# EAGLE design BusConOld (EAGLE 6.6.0)
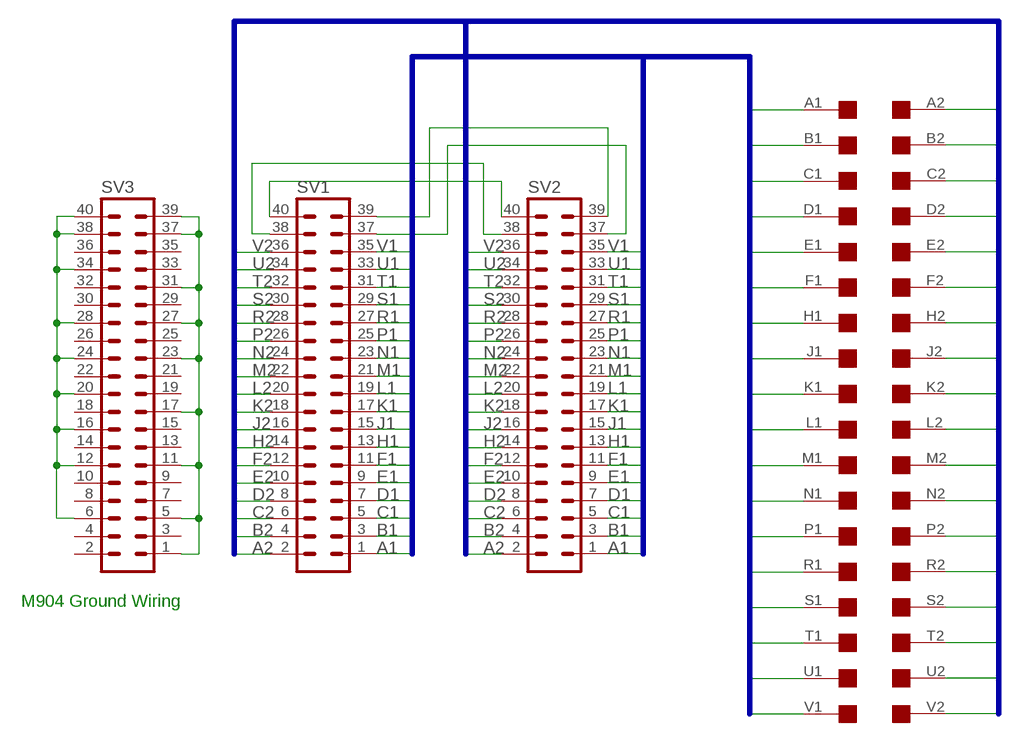
[diagram p0: schematic, sheet 1]

## Parts
SV1  MA20-2W  [MA20-2W]
SV2  MA20-2W  [MA20-2W]
SV3  MA20-2W  [MA20-2W]
U$1  DEC-FLIPCHIP  [DEC-FLIPCHIP]

## Nets
A1: SV1.1 SV2.1 U$1.A1
A2: SV1.2 SV2.2 U$1.A2
B1: SV1.3 SV2.3 U$1.B1
B2: SV1.4 SV2.4 U$1.B2
C1: SV1.5 SV2.5 U$1.C1
C2: SV1.6 SV2.6 U$1.C2
D1: SV1.7 SV2.7 U$1.D1
D2: SV1.8 SV2.8 U$1.D2
E1: SV1.9 SV2.9 U$1.E1
E2: SV1.10 SV2.10 U$1.E2
F1: SV1.11 SV2.11 U$1.F1
F2: SV1.12 SV2.12 U$1.F2
H1: SV1.13 SV2.13 U$1.H1
H2: SV1.14 SV2.14 U$1.H2
J1: SV1.15 SV2.15 U$1.J1
J2: SV1.16 SV2.16 U$1.J2
K1: SV1.17 SV2.17 U$1.K1
K2: SV1.18 SV2.18 U$1.K2
L1: SV1.19 SV2.19 U$1.L1
L2: SV1.20 SV2.20 U$1.L2
M1: SV1.21 SV2.21 U$1.M1
M2: SV1.22 SV2.22 U$1.M2
N1: SV1.23 SV2.23 U$1.N1
N2: SV1.24 SV2.24 U$1.N2
N$1: SV1.40 SV2.40
N$2: SV1.38 SV2.38
N$3: SV1.37 SV2.37
N$4: SV1.39 SV2.39
N$5: SV3.1 SV3.5 SV3.11 SV3.17 SV3.23 SV3.27 SV3.31 SV3.37 SV3.39
N$6: SV3.6 SV3.12 SV3.16 SV3.20 SV3.24 SV3.28 SV3.34 SV3.38 SV3.40
P1: SV1.25 SV2.25 U$1.P1
P2: SV1.26 SV2.26 U$1.P2
R1: SV1.27 SV2.27 U$1.R1
R2: SV1.28 SV2.28 U$1.R2
S1: SV1.29 SV2.29 U$1.S1
S2: SV1.30 SV2.30 U$1.S2
T1: SV1.31 SV2.31 U$1.T1
T2: SV1.32 SV2.32 U$1.T2
U1: SV1.33 SV2.33 U$1.U1
U2: SV1.34 SV2.34 U$1.U2
V1: SV1.35 SV2.35 U$1.V1
V2: SV1.36 SV2.36 U$1.V2
Unconnected: SV3.2 SV3.3 SV3.4 SV3.7 SV3.8 SV3.9 SV3.10 SV3.13 SV3.14 SV3.15 SV3.18 SV3.19 SV3.21 SV3.22 SV3.25 SV3.26 SV3.29 SV3.30 SV3.32 SV3.33 SV3.35 SV3.36

## Buses
A1,B1,C1,D1,E1,F1,H1,J1,K1,L1,M1,N1,P1,R1,S1,T1,U1,V1
A2,B2,C2,D2,E2,F2,H2,J2,K2,L2,M2,N2,P2,R2,S2,T2,U2,V2

## Notes on the sheet
- M904 Ground Wiring

## Library data of the parts
SV1-SV3 = con-lstb:MA20-2W: PIN HEADER; OC_FARNELL: unknown; OC_NEWARK: unknown
U$1 = con-dec:DEC-FLIPCHIP: DEC Flip-Chip single card fingers

## Board
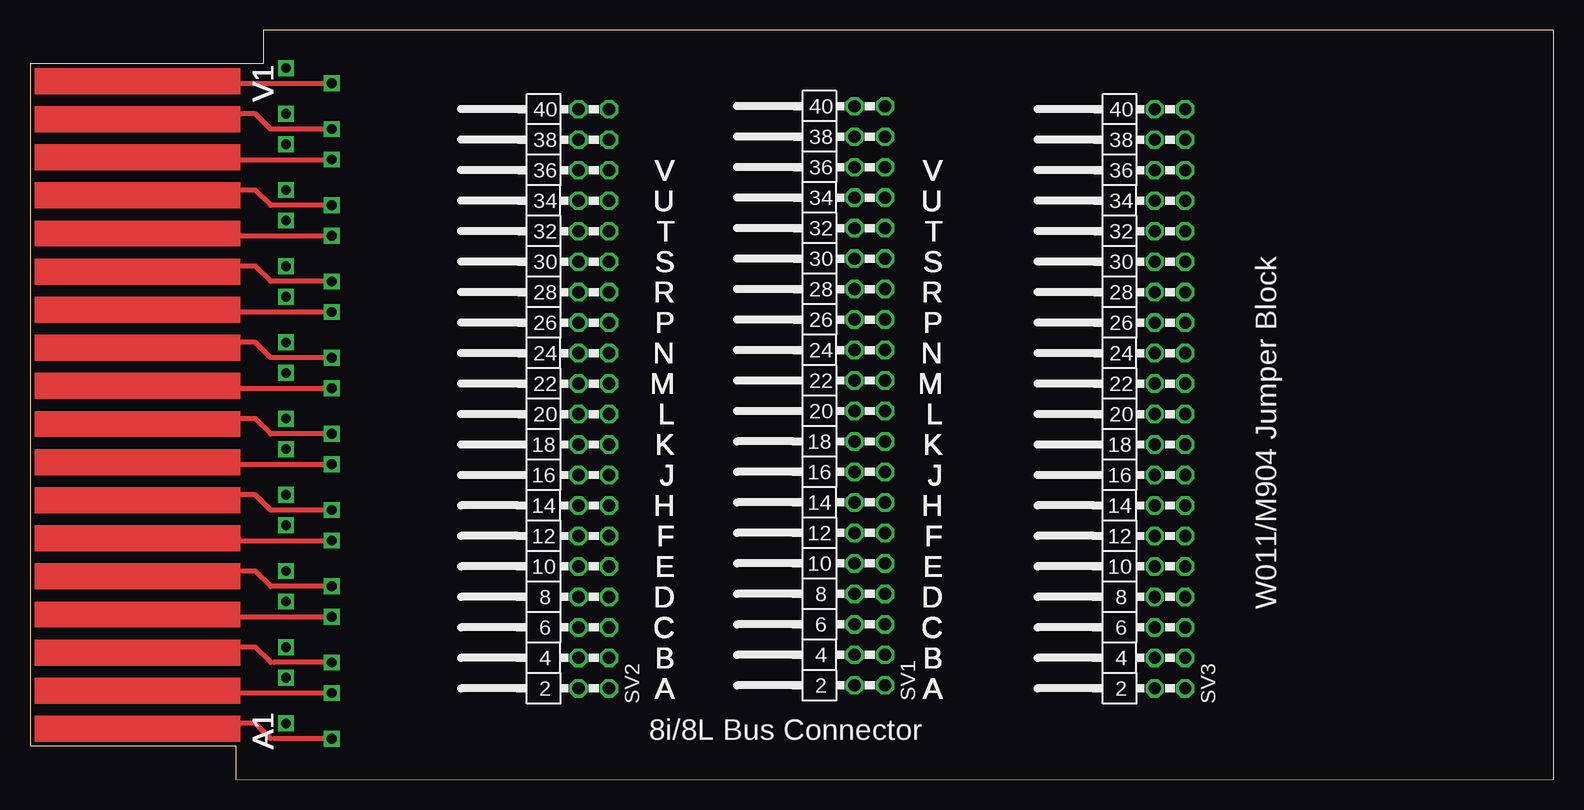
[diagram p1: board, top side]
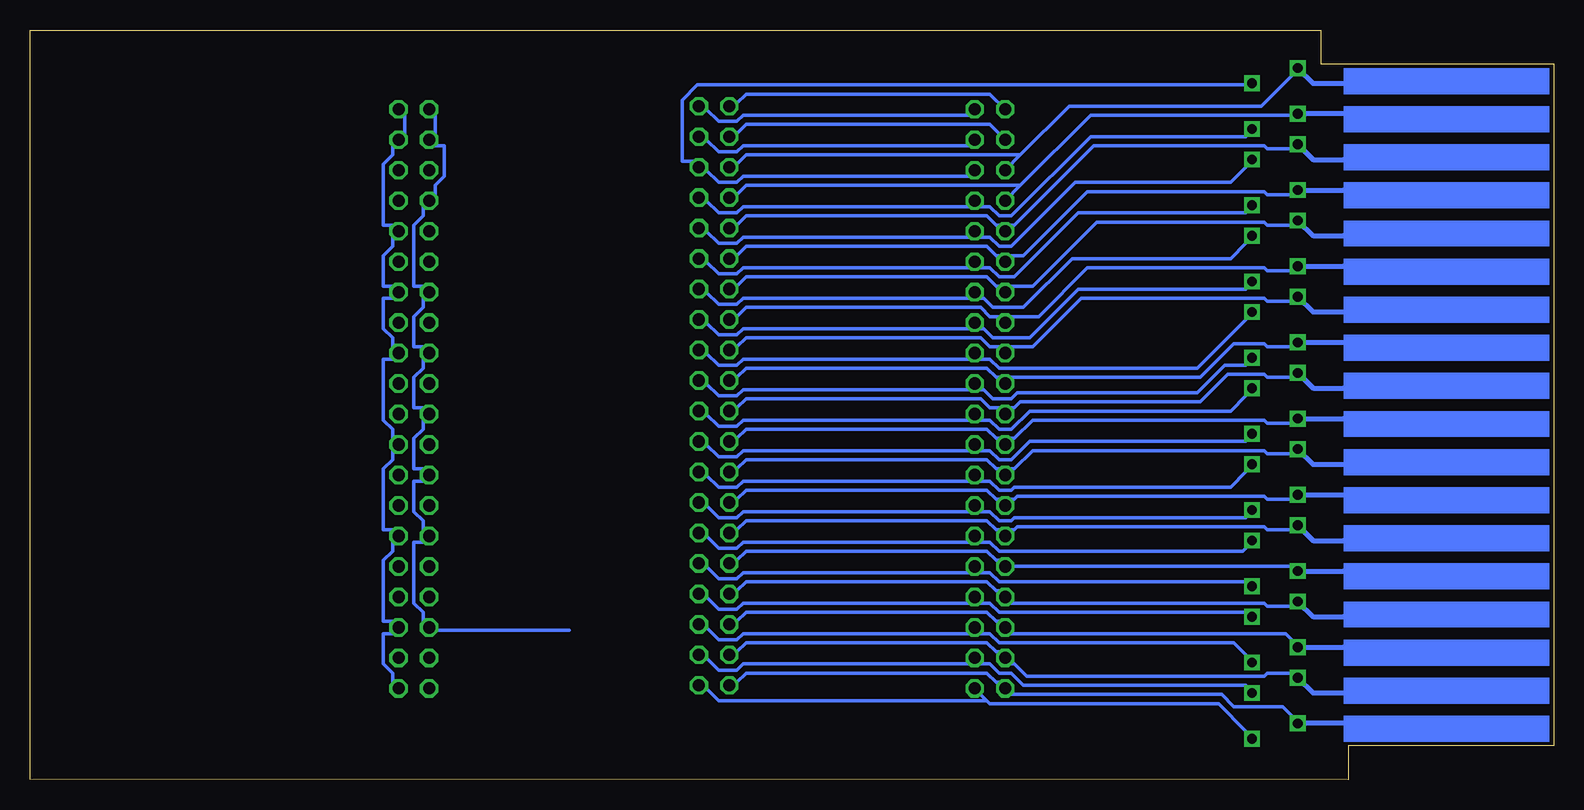
[diagram p2: board, bottom side, seen from below]

Size 126.98 x 62.48 mm. Coordinates in mm from the lower left corner, seen from the top.
Outline: 0,2.83 17.14,2.83 17.14,0 126.98,0.04 126.98,62.45 19.43,62.48 19.43,59.65 0,59.65 0,2.83
Copper layers (1*16): Top 0.035mm / dielectric 1.5mm / Bottom 0.035mm
Design rules "10mils": minimum track width 12mil, minimum drill 28mil, track to track 10mil, track to pad 10mil, pad to pad 10mil, via to via 10mil, smd to smd 10mil, copper to edge 40mil, drill to drill 10mil, minimum pad ring 10mil, minimum via ring 8mil, stop-mask expansion 0mil, vias tented up to drill 0mil, thermal gap 10mil

### Footprints (pad centres in the part's own frame; a part is rotated, then mirrored left to right if it is on the bottom)
MA20-2W = drill 1.016 octagon: 1 -24.13,-1.27; 2 -24.13,1.27; 3 -21.59,-1.27; 4 -21.59,1.27; 5 -19.05,-1.27; 6 -19.05,1.27; 7 -16.51,-1.27; 8 -16.51,1.27; 9 -13.97,-1.27; 10 -13.97,1.27; 11 -11.43,-1.27; 12 -11.43,1.27; 13 -8.89,-1.27; 14 -8.89,1.27; 15 -6.35,-1.27; 16 -6.35,1.27; 17 -3.81,-1.27; 18 -3.81,1.27; 19 -1.27,-1.27; 20 -1.27,1.27; 21 1.27,-1.27; 22 1.27,1.27; 23 3.81,-1.27; 24 3.81,1.27; 25 6.35,-1.27; 26 6.35,1.27; 27 8.89,-1.27; 28 8.89,1.27; 29 11.43,-1.27; 30 11.43,1.27; 31 13.97,-1.27; 32 13.97,1.27; 33 16.51,-1.27; 34 16.51,1.27; 35 19.05,-1.27; 36 19.05,1.27; 37 21.59,-1.27; 38 21.59,1.27; 39 24.13,-1.27; 40 24.13,1.27
DEC-FLIPCHIP = drill 0.813 square: A1 -7.62,27.94; A2 -3.81,26.67; B1 -7.62,24.13; B2 -3.81,22.86; C1 -7.62,21.59; C2 -3.81,20.32; D1 -7.62,17.78; D2 -3.81,16.51; E1 -7.62,15.24; E2 -3.81,13.97; F1 -7.62,11.43; F2 -3.81,10.16; H1 -7.62,8.89; H2 -3.81,7.62; J1 -7.62,5.08; J2 -3.81,3.81; K1 -7.62,2.54; K2 -3.81,1.27; L1 -7.62,-1.27; L2 -3.81,-2.54; M1 -7.62,-3.81; M2 -3.81,-5.08; N1 -7.62,-7.62; N2 -3.81,-8.89; P1 -7.62,-10.16; P2 -3.81,-11.43; R1 -7.62,-13.97; R2 -3.81,-15.24; S1 -7.62,-16.51; S2 -3.81,-17.78; T1 -7.62,-20.32; T2 -3.81,-21.59; U1 -7.62,-22.86; U2 -3.81,-24.13; V1 -7.62,-26.67; V2 -3.81,-27.94

### Placement (x,y rotation side)
SV1  69.97,32 90 top
SV2  46.98,31.75 90 top
SV3  94.99,31.75 90 top
U$1  17.52,31.37 180 top

### Tracks (layer width: path | path; a pad name or v marks a point on that pad's centre or on a via)
A1
  Bottom 0.305: 47.24,6.6 46.98,6.35 27.94,6.35 25.65,4.06 U$1.A1 | 47.24,6.6 SV2.1 | 47.24,6.6 69.59,6.6 70.61,7.62 SV1.1
A2
  Bottom 0.305: U$1.A2 21.84,5.33 22.6,6.1 26.67,6.1 27.68,7.11 45.21,7.11 SV2.2 46.22,8.13 46.48,8.13 47.24,8.89 67.31,8.89 68.07,8.13 SV1.2
B1
  Bottom 0.305: U$1.B1 25.65,7.87 44.19,7.87 45.21,8.89 46.22,8.89 46.98,9.65 47.75,9.65 SV2.3 48.76,9.65 67.56,9.65 68.07,9.14 69.59,9.14 70.61,10.16 SV1.3
B2
  Bottom 0.305: U$1.B2 21.84,8.89 23.87,8.89 24.12,8.64 43.94,8.64 44.95,9.65 45.21,9.65 SV2.4 46.22,10.67 46.48,10.67 47.24,11.43 67.31,11.43 68.07,10.67 SV1.4
C1
  Bottom 0.305: U$1.C1 25.65,10.41 26.67,11.43 46.22,11.43 46.98,12.19 47.75,12.19 SV2.5 48.76,12.19 67.56,12.19 68.07,11.68 69.59,11.68 70.61,12.7 SV1.5
C2
  Bottom 0.305: U$1.C2 21.84,11.68 22.35,12.19 45.21,12.19 SV2.6 46.22,13.21 46.48,13.21 47.24,13.97 67.31,13.97 68.07,13.21 SV1.6
D1
  Bottom 0.305: U$1.D1 25.65,13.97 46.22,13.97 46.98,14.73 47.75,14.73 SV2.7 48.76,14.73 67.56,14.73 68.07,14.22 69.59,14.22 70.61,15.24 SV1.7
D2
  Bottom 0.305: U$1.D2 21.84,14.48 23.87,14.48 24.12,14.73 45.21,14.73 SV2.8 46.22,15.75 46.48,15.75 47.24,16.51 67.31,16.51 68.07,15.75 SV1.8
E1
  Bottom 0.305: U$1.E1 25.65,16.51 46.22,16.51 46.98,17.27 47.75,17.27 SV2.9 48.76,17.27 67.56,17.27 68.07,16.76 69.59,16.76 70.61,17.78 SV1.9
E2
  Bottom 0.305: U$1.E2 21.84,17.78 SV2.10 46.22,18.29 46.48,18.29 47.24,19.05 67.31,19.05 68.07,18.29 SV1.10
F1
  Bottom 0.305: U$1.F1 25.65,19.3 25.9,19.05 46.22,19.05 46.98,19.81 47.75,19.81 SV2.11 48.76,19.81 67.56,19.81 68.07,19.3 69.59,19.3 70.61,20.32 SV1.11
F2
  Bottom 0.305: U$1.F2 21.84,20.83 23.87,20.83 24.12,21.08 44.7,21.08 44.95,20.83 45.21,20.83 SV2.12 46.22,20.83 46.48,20.83 47.24,21.59 67.31,21.59 68.07,20.83 SV1.12
H1
  Bottom 0.305: U$1.H1 25.65,21.84 44.95,21.84 45.21,21.59 46.22,21.59 46.98,22.35 47.75,22.35 SV2.13 48.76,22.35 67.56,22.35 68.07,21.84 69.59,21.84 70.61,22.86 SV1.13
H2
  Bottom 0.305: U$1.H2 21.84,23.37 23.87,23.37 24.12,23.62 44.7,23.62 44.95,23.37 45.21,23.37 SV2.14 46.22,23.37 46.48,23.37 47.24,24.13 67.31,24.13 68.07,23.37 SV1.14
J1
  Bottom 0.305: U$1.J1 25.65,25.65 26.92,24.38 44.95,24.38 45.21,24.13 46.22,24.13 46.98,24.89 47.75,24.89 SV2.15 48.76,24.89 67.56,24.89 68.07,24.38 69.59,24.38 70.61,25.4 SV1.15
J2
  Bottom 0.305: U$1.J2 21.84,27.18 23.87,27.18 24.12,27.43 43.43,27.43 44.95,25.91 45.21,25.91 SV2.16 46.22,25.91 46.48,25.91 47.24,26.67 67.31,26.67 68.07,25.91 SV1.16
K1
  Bottom 0.305: U$1.K1 25.65,28.19 43.68,28.19 45.21,26.67 46.22,26.67 46.98,27.43 47.75,27.43 SV2.17 48.76,27.43 67.56,27.43 68.07,26.92 69.59,26.92 70.61,27.94 SV1.17
K2
  Bottom 0.305: U$1.K2 21.84,29.72 23.87,29.72 24.12,29.97 43.43,29.97 44.95,28.45 45.21,28.45 SV2.18 46.22,28.45 46.48,28.45 47.24,29.21 67.31,29.21 68.07,28.45 SV1.18
L1
  Bottom 0.305: U$1.L1 25.65,32 26.92,30.73 43.68,30.73 45.21,29.21 46.22,29.21 46.98,29.97 47.75,29.97 SV2.19 48.76,29.97 67.56,29.97 68.07,29.46 69.59,29.46 70.61,30.48 SV1.19
L2
  Bottom 0.305: SV1.20 68.07,30.99 67.31,31.75 47.75,31.75 46.98,30.99 46.22,30.99 SV2.20 45.21,30.99 44.95,30.99 44.45,31.5 29.46,31.5 27.17,33.78 24.12,33.78 23.87,33.53 21.84,33.53 U$1.L2
M1
  Bottom 0.305: SV1.21 70.61,33.02 69.59,32 68.07,32 67.56,32.51 48.76,32.51 SV2.21 47.75,32.51 47.49,32.51 46.73,31.75 45.21,31.75 44.7,32.26 29.71,32.26 27.43,34.54 25.65,34.54 U$1.M1
M2
  Bottom 0.305: SV1.22 68.07,33.53 67.31,34.29 47.24,34.29 46.48,33.53 46.22,33.53 SV2.22 45.21,33.53 29.46,33.53 26.67,36.32 24.12,36.32 23.87,36.07 21.84,36.07 U$1.M2
N1
  Bottom 0.305: SV1.23 70.61,35.56 69.59,34.54 68.07,34.54 67.56,35.05 48.76,35.05 SV2.23 47.75,35.05 46.98,35.05 46.22,34.29 29.71,34.29 25.65,38.35 U$1.N1
N2
  Bottom 0.305: SV1.24 68.07,36.07 67.31,36.83 47.75,36.83 46.98,36.07 46.22,36.07 SV2.24 45.21,36.07 43.43,36.07 39.36,40.13 24.12,40.13 23.87,39.88 21.84,39.88 U$1.N2
N$1
  Bottom 0.305: SV2.40 46.98,57.15 67.31,57.15 68.07,56.39 SV1.40
N$2
  Bottom 0.305: SV2.38 46.98,54.61 67.31,54.61 68.07,53.85 SV1.38
N$3
  Bottom 0.305: SV2.37 48.76,52.83 67.56,52.83 68.07,52.32 69.59,52.32 70.61,53.34 SV1.37
N$4
  Bottom 0.305: SV2.39 48.76,55.37 67.56,55.37 68.07,54.86 69.59,54.86 70.61,55.88 SV1.39
N$5
  Bottom 0.305: SV3.1 96.77,8.13 96.77,8.89 97.53,9.65 97.53,12.19 96.77,12.19 SV3.5 96.77,13.21 97.53,13.21 97.53,18.29 96.77,19.05 96.77,19.81 SV3.11 96.77,20.83 97.53,20.83 97.53,25.91 96.77,26.67 96.77,27.43 SV3.17 96.77,28.45 96.77,29.21 97.53,29.97 97.53,35.05 96.77,35.05 SV3.23 96.77,36.07 96.77,36.83 97.53,37.59 97.53,40.13 96.77,40.13 SV3.27 96.77,41.15 97.53,41.15 97.53,43.69 96.77,44.45 96.77,45.21 SV3.31 96.77,46.23 97.53,46.23 97.53,51.31 96.77,52.07 96.77,52.83 SV3.37 95.75,53.85 95.75,55.37 SV3.39
N$6
  Bottom 0.305: 82.04,12.45 93.21,12.45 SV3.6 94.23,13.21 94.23,13.97 94.99,14.73 94.99,19.81 94.23,19.81 SV3.12 94.23,20.83 94.23,21.59 94.99,22.35 94.99,24.89 94.23,24.89 SV3.16 94.23,25.91 94.99,25.91 94.99,28.45 94.23,29.21 94.23,29.97 SV3.20 94.23,30.99 94.99,30.99 94.99,33.53 94.23,34.29 94.23,35.05 SV3.24 94.23,36.07 94.99,36.07 94.99,38.61 94.23,39.37 94.23,40.13 SV3.28 94.23,41.15 94.99,41.15 94.99,46.23 94.23,46.99 94.23,47.75 SV3.34 93.21,48.77 93.21,49.53 92.45,50.29 92.45,52.83 93.21,52.83 SV3.38 93.21,53.85 93.21,55.37 SV3.40
P1
  Bottom 0.305: SV1.25 70.61,38.1 69.59,37.08 68.07,37.08 67.56,37.59 48.76,37.59 SV2.25 47.75,37.59 47.49,37.59 46.73,36.83 43.68,36.83 39.62,40.89 25.65,40.89 U$1.P1
P2
  Bottom 0.305: SV1.26 68.07,38.61 67.31,39.37 47.75,39.37 46.98,38.61 46.22,38.61 SV2.26 45.21,38.61 42.92,38.61 38.86,42.67 24.12,42.67 23.87,42.42 21.84,42.42 U$1.P2
R1
  Bottom 0.305: SV1.27 70.61,40.64 69.59,39.62 68.07,39.62 67.56,40.13 48.76,40.13 SV2.27 47.75,40.13 47.49,40.13 46.73,39.37 44.19,39.37 40.13,43.43 26.92,43.43 25.65,44.7 U$1.R1
R2
  Bottom 0.305: U$1.R2 21.84,46.23 23.87,46.23 24.12,46.48 38.09,46.48 43.43,41.15 45.21,41.15 SV2.28 46.22,41.15 46.48,41.15 47.24,41.91 67.31,41.91 68.07,41.15 SV1.28
S1
  Bottom 0.305: SV1.29 70.61,43.18 69.59,42.16 68.07,42.16 67.56,42.67 48.76,42.67 SV2.29 47.75,42.67 46.98,42.67 46.22,41.91 44.95,41.91 39.62,47.24 25.65,47.24 U$1.S1
S2
  Bottom 0.305: U$1.S2 21.84,48.77 23.87,48.77 24.12,49.02 38.86,49.02 44.19,43.69 45.21,43.69 SV2.30 46.22,43.69 46.48,43.69 47.24,44.45 67.31,44.45 68.07,43.69 SV1.30
T1
  Bottom 0.305: U$1.T1 25.65,51.05 26.92,49.78 39.87,49.78 45.21,44.45 46.22,44.45 46.98,45.21 47.75,45.21 SV2.31 48.76,45.21 67.56,45.21 68.07,44.7 69.59,44.7 70.61,45.72 SV1.31
T2
  Bottom 0.305: U$1.T2 21.84,52.58 23.87,52.58 24.12,52.83 38.35,52.83 44.95,46.23 45.21,46.23 SV2.32 46.22,46.23 46.48,46.23 47.24,46.99 67.31,46.99 68.07,46.23 SV1.32
U1
  Bottom 0.305: U$1.U1 25.65,53.59 38.6,53.59 45.21,46.99 46.22,46.99 46.98,47.75 47.75,47.75 SV2.33 48.76,47.75 67.56,47.75 68.07,47.24 69.59,47.24 70.61,48.26 SV1.33
U2
  Bottom 0.305: 44.45,49.53 38.6,55.37 21.84,55.37 U$1.U2 | 44.45,49.53 SV2.34 | 44.45,49.53 67.31,49.53 68.07,48.77 SV1.34
V1
  Bottom 0.305: U$1.V1 25.65,57.91 71.37,57.91 72.64,56.64 72.64,51.56 71.62,51.56 SV1.35 70.61,50.8 69.59,49.78 68.07,49.78 67.56,50.29 48.76,50.29 SV2.35
V2
  Bottom 0.305: 44.45,52.07 40.38,56.13 24.38,56.13 21.84,58.67 U$1.V2 | 44.45,52.07 SV2.36 | 44.45,52.07 67.31,52.07 68.07,51.31 SV1.36

### Text on the board
tPlace: W011/M904 Jumper Block | 8i/8L Bus Connector
tNames: V1 | V1 | V1 | V1 | V1 | V1 | V1 | V1 | V1 | V1 | V1 | V1 | V1 | V1 | V1 | V1 | V1 | V1 | V1 | V1 | V1 | V1 | V1 | V1 | V1 | V1 | V1 | V1 | V1 | V1 | V1 | V1 | V | V | V | V | V | V | V | V | V | V | V | V | V | V | V | V | V | V | V | V | V | V | V | V | V | V | V | V | V | V | V | V | V | V | V | V | V | V | V | V | V | V | V | V | V | V | V | V | V | V | V | V | V | V | V | V | V | V | V | V | V | V | V | V | U | U | U | U | U | U | U | U | U | U | U | U | U | U | U | U | U | U | U | U | U | U | U | U | U | U | U | U | U | U | U | U | U | U | U | U | U | U | U | U | U | U | U | U | U | U | U | U | U | U | U | U | U | U | U | U | U | U | U | U | U | U | U | U | T | T | T | T | T | T | T | T | T | T | T | T | T | T | T | T | T | T | T | T | T | T | T | T | T | T | T | T | T | T | T | T | T | T | T | T | T | T | T | T | T | T | T | T | T | T | T | T | T | T | T | T | T | T | T | T | T | T | T | T | T | T | T | T | S | S | S | S | S | S | S | S | S | S | S | S | S | S | S | S | S | S | S | S | S | S | S | S | S | S | S | S | S | S | S | S | S | S | S | S | S | S | S | S | S | S | S | S | S | S | S | S | S | S | S | S | S | S | S | S | S | S | S | S | S | S | S | S | R | R | R | R | R | R | R | R | R | R | R | R | R | R | R | R | R | R | R | R | R | R | R | R | R | R | R | R | R | R | R | R | R | R | R | R | R | R | R | R | R | R | R | R | R | R | R | R | R | R | R | R | R | R | R | R | R | R | R | R | R | R | R | R | P | P | P | P | P | P | P | P | P | P | P | P | P | P | P | P | P | P | P | P | P | P | P | P | P | P | P | P | P | P | P | P | P | P | P | P | P | P | P | P | P | P | P | P | P | P | P | P | P | P | P | P | P | P | P | P | P | P | P | P | P | P | P | P | N | N | N | N | N | N | N | N | N | N | N | N | N | N | N | N | N | N | N | N | N | N | N | N | N | N | N | N | N | N | N | N | N | N | N | N | N | N | N | N | N | N | N | N | N | N | N | N | N | N | N | N | N | N | N | N | N | N | N | N | N | N | N | N | M | M | M | M | M | M | M | M | M | M | M | M | M | M | M | M | M | M | M | M | M | M | M | M | M | M | M | M | M | M | M | M | M | M | M | M | M | M | M | M | M | M | M | M | M | M | M | M | M | M | M | M | M | M | M | M | M | M | M | M | M | M | M | M | L | L | L | L | L | L | L | L | L | L | L | L | L | L | L | L | L | L | L | L | L | L | L | L | L | L | L | L | L | L | L | L | L | L | L | L | L | L | L | L | L | L | L | L | L | L | L | L | L | L | L | L | L | L | L | L | L | L | L | L | L | L | L | L | K | K | K | K | K | K | K | K | K | K | K | K | K | K | K | K | K | K | K | K | K | K | K | K | K | K | K | K | K | K | K | K | K | K | K | K | K | K | K | K | K | K | K | K | K | K | K | K | K | K | K | K | K | K | K | K | K | K | K | K | K | K | K | K | J | J | J | J | J | J | J | J | J | J | J | J | J | J | J | J | J | J | J | J | J | J | J | J | J | J | J | J | J | J | J | J | J | J | J | J | J | J | J | J | J | J | J | J | J | J | J | J | J | J | J | J | J | J | J | J | J | J | J | J | J | J | J | J | H | H | H | H | H | H | H | H | H | H | H | H | H | H | H | H | H | H | H | H | H | H | H | H | H | H | H | H | H | H | H | H | H | H | H | H | H | H | H | H | H | H | H | H | H | H | H | H | H | H | H | H | H | H | H | H | H | H | H | H | H | H | H | H | F | F | F | F | F | F | F | F | F | F | F | F | F | F | F | F | F | F | F | F | F | F | F | F | F | F | F | F | F | F | F | F | F | F | F | F | F | F | F | F | F | F | F | F | F | F | F | F | F | F | F | F | F | F | F | F | F | F | F | F | F | F | F | F | E | E | E | E | E | E | E | E | E | E | E | E | E | E | E | E | E | E | E | E | E | E | E | E | E | E | E | E | E | E | E | E | E | E | E | E | E | E | E | E | E | E | E | E | E | E | E | E | E | E | E | E | E | E | E | E | E | E | E | E | E | E | E | E | D | D | D | D | D | D | D | D | D | D | D | D | D | D | D | D | D | D | D | D | D | D | D | D | D | D | D | D | D | D | D | D | D | D | D | D | D | D | D | D | D | D | D | D | D | D | D | D | D | D | D | D | D | D | D | D | D | D | D | D | D | D | D | D | C | C | C | C | C | C | C | C | C | C | C | C | C | C | C | C | C | C | C | C | C | C | C | C | C | C | C | C | C | C | C | C | C | C | C | C | C | C | C | C | C | C | C | C | C | C | C | C | C | C | C | C | C | C | C | C | C | C | C | C | C | C | C | C | B | B | B | B | B | B | B | B | B | B | B | B | B | B | B | B | B | B | B | B | B | B | B | B | B | B | B | B | B | B | B | B | B | B | B | B | B | B | B | B | B | B | B | B | B | B | B | B | B | B | B | B | B | B | B | B | B | B | B | B | B | B | B | B | A | A | A | A | A | A | A | A | A | A | A | A | A | A | A | A | A | A | A | A | A | A | A | A | A | A | A | A | A | A | A | A | A | A | A | A | A | A | A | A | A | A | A | A | A | A | A | A | A | A | A | A | A | A | A | A | A | A | A | A | A | A | A | A | A1 | A1 | A1 | A1 | A1 | A1 | A1 | A1 | A1 | A1 | A1 | A1 | A1 | A1 | A1 | A1 | A1 | A1 | A1 | A1 | A1 | A1 | A1 | A1 | A1 | A1 | A1 | A1 | A1 | A1 | A1 | A1